# EAGLE schematic Rotary Encoder - basic (EAGLE 6.2)
SKAARHOJ 2012 Rotary Encoder Breakout Board
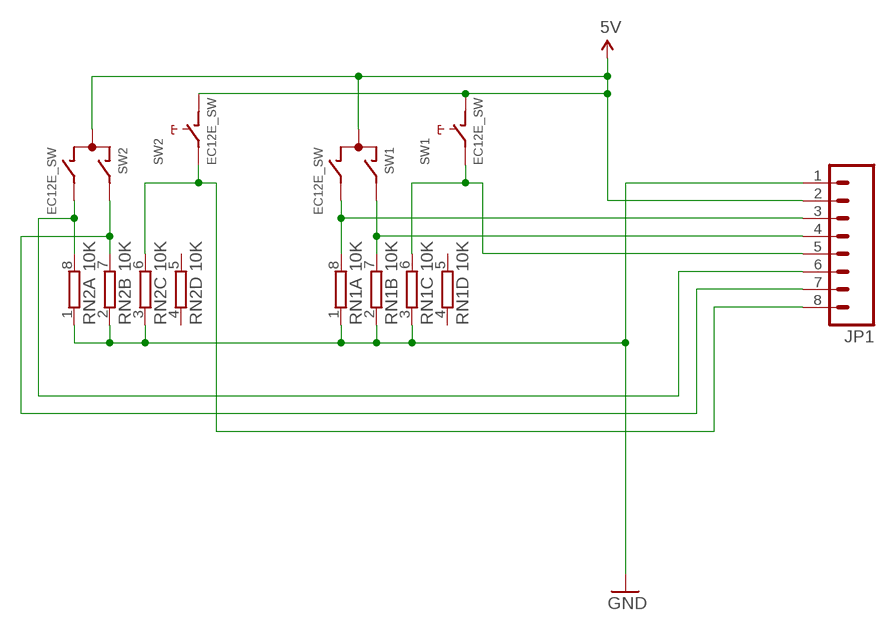
[diagram p0: schematic, sheet 1]

## Parts
JP1  M08LOCK  [1X08_LOCK]
RN1  10K  4R-NCAY16  [CAY16_HAND]
RN2  10K  4R-NCAY16  [CAY16_HAND]
SW1  EC12E_SW  [ALPS_EC12E_SW]
SW2  EC12E_SW  [ALPS_EC12E_SW]

## Nets
5V: JP1.2 SW1.C SW1.D SW2.C SW2.D
GND: JP1.1 RN1.1 RN1.2 RN1.3 RN2.1 RN2.2 RN2.3
JP1: JP1.6 RN2.8 SW2.B
N$1: JP1.3 RN1.8 SW1.B
N$2: JP1.4 RN1.7 SW1.A
N$3: JP1.5 RN1.6 SW1.E
N$5: JP1.7 RN2.7 SW2.A
N$6: JP1.8 RN2.6 SW2.E
Unconnected: RN1.4 RN1.5 RN2.4 RN2.5 SW1.GND1(G) SW1.GND2(G) SW2.GND1(G) SW2.GND2(G)

## Library data of the parts
JP1 = SparkFun:M08: Header 8 Standard 8-pin 0.1" header. Use with straight break away headers (SKU : PRT-00116), right angle break away headers (PRT-00553), swiss pins (PRT-00743), machine pins (PRT-00117), and female headers (PRT-00115).
RN1 RN2 = SKAARHOJ:4R-N: Array Chip Resistor Source: RS Component / Phycomp; OC_FARNELL: unknown; OC_NEWARK: unknown
SW1 SW2 = switch-alps:EC12E_SW: ALPS rotary Encoder EC12E series with switch; MPN: EC12E2424407; OC_FARNELL: 1520813; OC_NEWARK: 74M1068

## Net classes
0 default: width 0.305 mm, clearance 0.305 mm